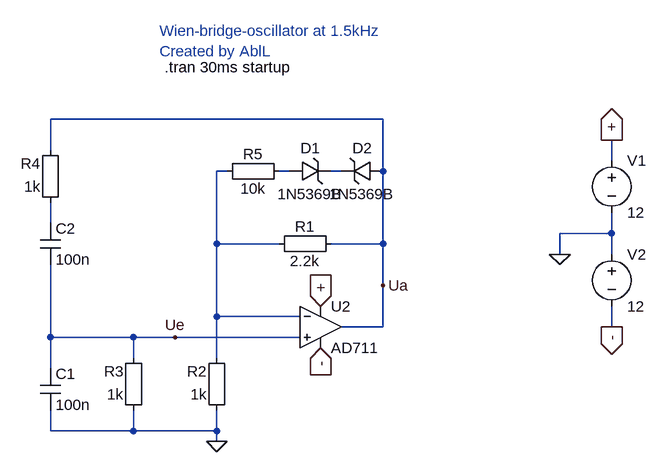
[diagram p0: schematic Wien-Robinson-Oszillator.asc]
Wien-Robinson-Oszillator.asc, the LTspice schematic file:
Version 4
SHEET 1 880 680
WIRE 432 -128 -80 -128
WIRE -80 -80 -80 -128
WIRE 784 -64 784 -96
WIRE 192 -48 176 -48
WIRE 288 -48 272 -48
WIRE 368 -48 352 -48
WIRE 432 -48 432 -128
WIRE -80 32 -80 0
WIRE 784 48 784 16
WIRE 784 48 704 48
WIRE 176 64 176 -48
WIRE 272 64 176 64
WIRE 432 64 432 -48
WIRE 432 64 352 64
WIRE 704 80 704 48
WIRE 784 80 784 48
WIRE 432 128 432 64
WIRE 176 176 176 64
WIRE 304 176 176 176
WIRE 432 192 432 128
WIRE 432 192 368 192
WIRE 784 192 784 160
WIRE -80 208 -80 96
WIRE 48 208 -80 208
WIRE 112 208 48 208
WIRE 304 208 112 208
WIRE 48 240 48 208
WIRE 176 240 176 176
WIRE -80 256 -80 208
WIRE -80 352 -80 320
WIRE 48 352 48 320
WIRE 48 352 -80 352
WIRE 176 352 176 320
WIRE 176 352 48 352
WIRE 176 368 176 352
FLAG 336 160 +
IOPIN 336 160 In
FLAG 336 224 -
IOPIN 336 224 In
FLAG 784 -96 +
IOPIN 784 -96 Out
FLAG 784 192 -
IOPIN 784 192 Out
FLAG 704 80 0
FLAG 176 368 0
FLAG 432 128 Ua
FLAG 112 208 Ue
SYMBOL Misc\\EuropeanResistor 368 48 R90
WINDOW 0 5 56 VBottom 2
WINDOW 3 27 56 VTop 2
SYMATTR InstName R1
SYMATTR Value 2.2k
SYMBOL Misc\\EuropeanResistor 192 336 R180
WINDOW 0 31 76 Left 2
WINDOW 3 31 40 Left 2
SYMATTR InstName R2
SYMATTR Value 1k
SYMBOL Misc\\EuropeanResistor 64 336 R180
WINDOW 0 31 76 Left 2
WINDOW 3 31 40 Left 2
SYMATTR InstName R3
SYMATTR Value 1k
SYMBOL cap -96 256 R0
SYMATTR InstName C1
SYMATTR Value 100n
SYMBOL cap -96 32 R0
SYMATTR InstName C2
SYMATTR Value 100n
SYMBOL Misc\\EuropeanResistor -64 16 R180
WINDOW 0 31 76 Left 2
WINDOW 3 31 40 Left 2
SYMATTR InstName R4
SYMATTR Value 1k
SYMBOL voltage 784 -80 R0
WINDOW 123 0 0 Left 0
WINDOW 39 0 0 Left 0
SYMATTR InstName V1
SYMATTR Value 12
SYMBOL voltage 784 64 R0
WINDOW 123 0 0 Left 0
WINDOW 39 0 0 Left 0
SYMATTR InstName V2
SYMATTR Value 12
SYMBOL Misc\\EuropeanResistor 288 -64 R90
WINDOW 0 5 56 VBottom 2
WINDOW 3 27 56 VTop 2
SYMATTR InstName R5
SYMATTR Value 10k
SYMBOL zener 288 -32 R270
WINDOW 0 36 32 VTop 2
WINDOW 3 -4 32 VBottom 2
SYMATTR InstName D1
SYMATTR Value 1N5369B
SYMBOL zener 432 -64 R90
WINDOW 0 -4 32 VBottom 2
WINDOW 3 36 32 VTop 2
SYMATTR InstName D2
SYMATTR Value 1N5369B
SYMBOL Opamps\\AD711 336 128 R0
SYMATTR InstName U2
TEXT 96 -208 Left 2 !.tran 30ms startup
TEXT 88 -264 Left 2 ;Wien-bridge-oscillator at 1.5kHz\nCreated by AblL

The netlist it stands for:
* Wien-Robinson-Oszillator.asc
R1 Ua N001 2.2k
R2 0 N001 1k
R3 0 Ue 1k
C1 Ue 0 100n
C2 N004 Ue 100n
R4 N004 Ua 1k
V1 + 0 12
V2 0 - 12
R5 N002 N001 10k
D1 N002 N003 1N5369B
D2 Ua N003 1N5369B
XU2 Ue N001 + - Ua AD712  ; AD711, pins In+ In- V+ V- OUT
.model D D
.lib standard.dio
.tran 30ms startup
* Wien-bridge-oscillator at 1.5kHz
* Created by AblL
.lib ADI1.lib
.backanno
.end